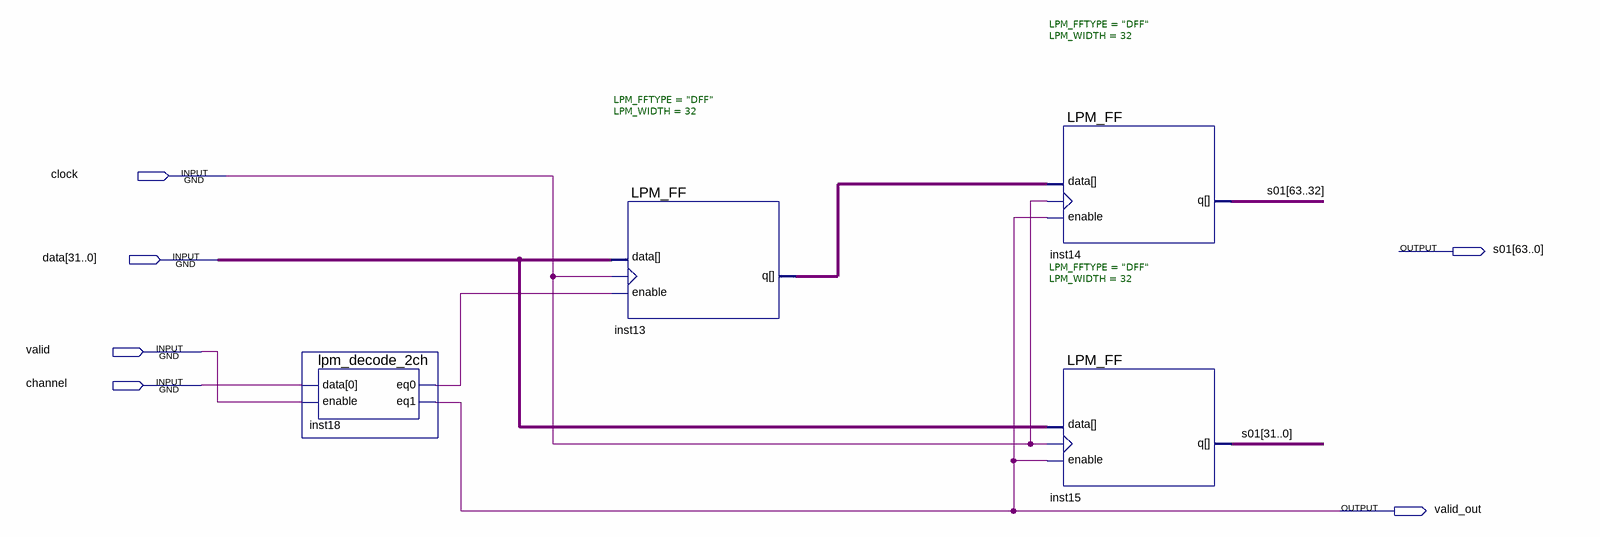
[diagram p0: schematic sheet]
// Quartus schematic avalon_to_64bit.bdf as structural Verilog: 4 symbols, 6 pins
module avalon_to_64bit (
  input  clock,
  input  [31:0] data,
  input  valid,
  input  channel,
  output [63:0] s01,
  output valid_out
);

  wire inst18_eq0;
  wire [31:0] inst13_q;

  lpm_decode_2ch inst18 (.data(channel), .enable(valid), .eq0(inst18_eq0), .eq1(valid_out));
  LPM_FF #(.LPM_FFTYPE("DFF"), .LPM_WIDTH(32)) inst13 (.enable(inst18_eq0), .clock(clock), .data(data), .q(inst13_q));
  LPM_FF #(.LPM_FFTYPE("DFF"), .LPM_WIDTH(32)) inst14 (
    .enable(valid_out), .clock(clock), .data(inst13_q), .q(s01[63:32]));
  LPM_FF #(.LPM_FFTYPE("DFF"), .LPM_WIDTH(32)) inst15 (.enable(valid_out), .clock(clock), .data(data), .q(s01[31:0]));
endmodule
